# EAGLE schematic SMIW Project schematic (EAGLE 8.2.1)
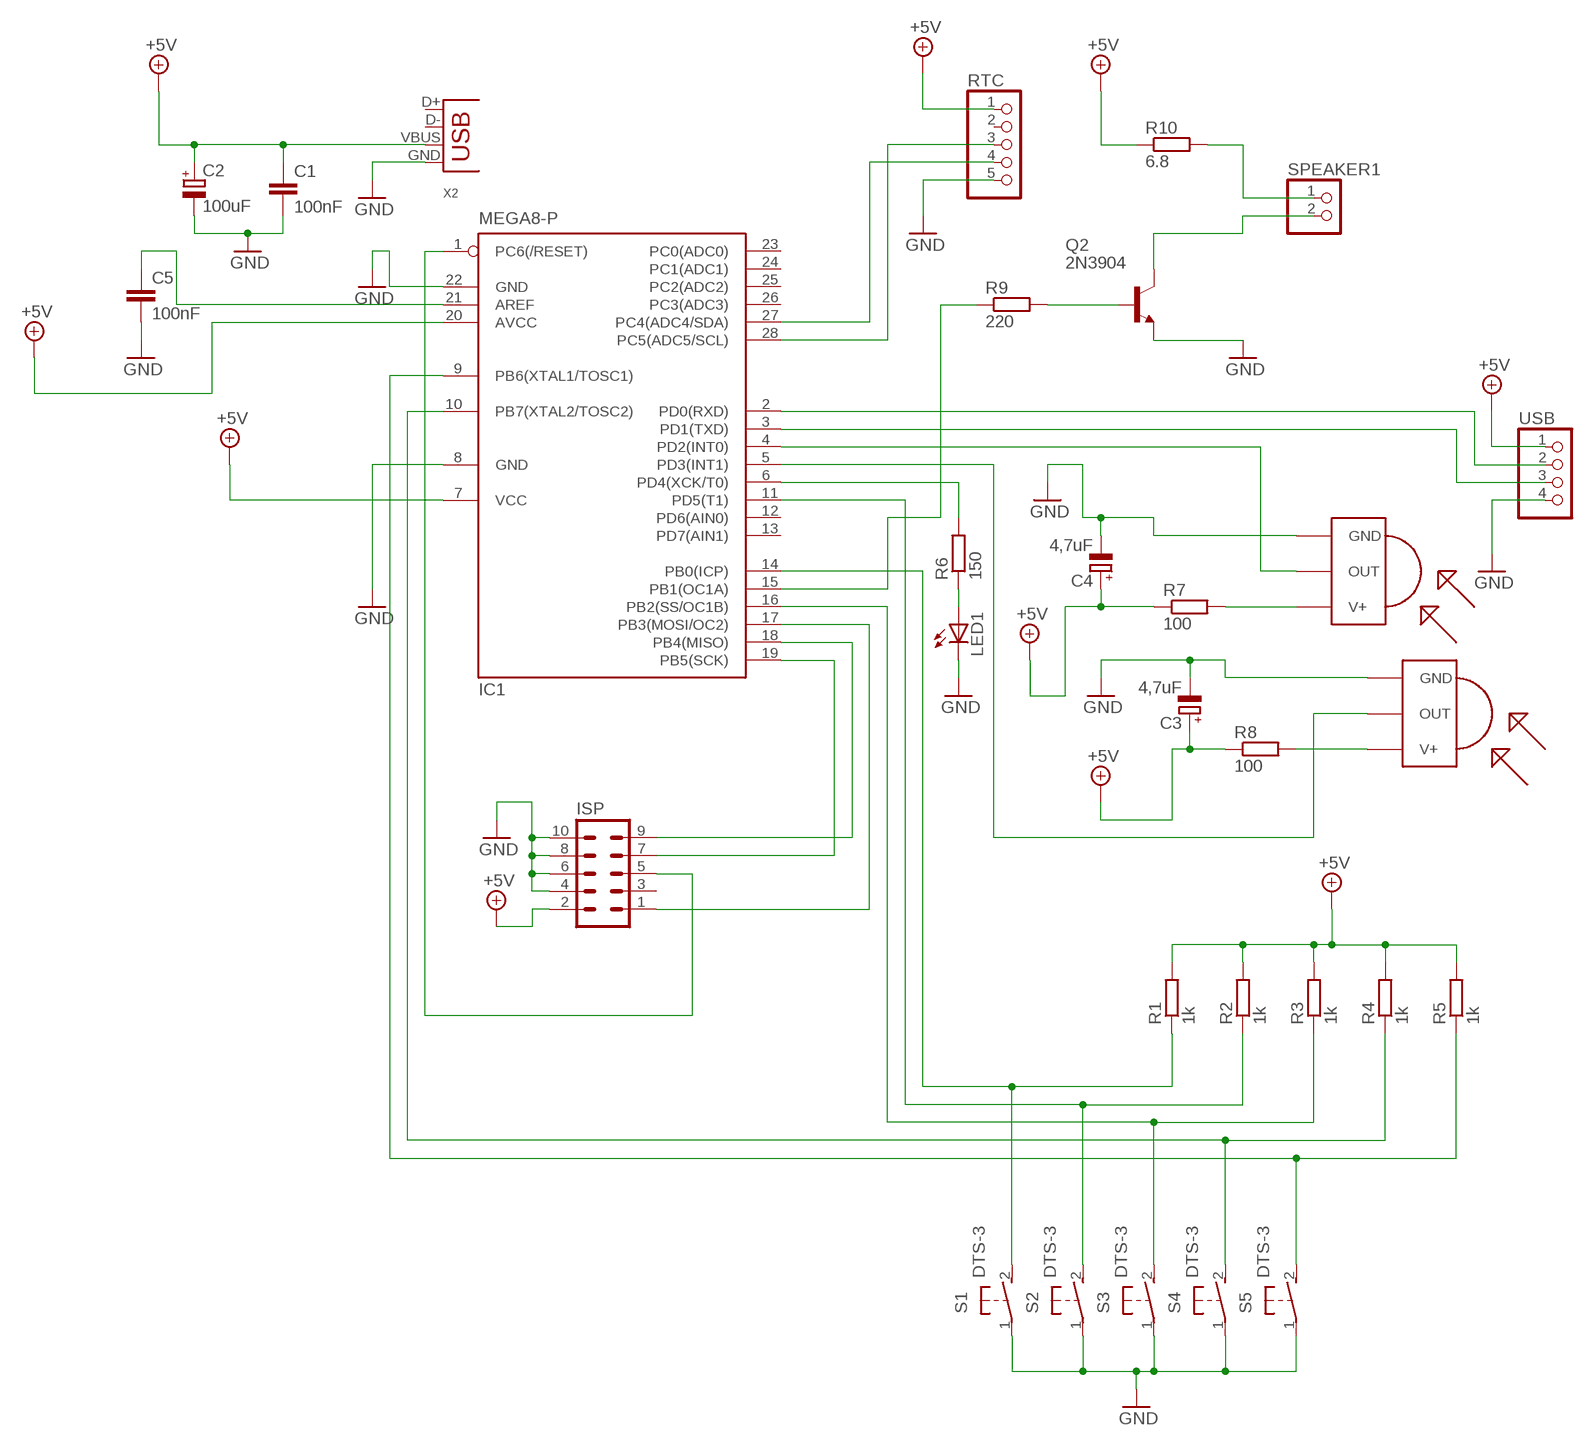
[diagram p0: schematic, sheet 1]

## Parts
C1  100nF  C2,5-3  [C2.5-3]
C2  100uF  CPOL-EUTT2D6  [TT2D6]
C3  4,7uF  CPOL-EUTT2D6  [TT2D6]
C4  4,7uF  CPOL-EUTT2D6  [TT2D6]
C5  100nF  C2,5-3  [C2.5-3]
IC1  MEGA8-P  [DIL28-3]
IRR1  TSOP4836  [TSOP18XX]
IRR2  TSOP4836  [TSOP18XX]
ISP  ML10  [ML10]
LED1  LED3MM  [LED3MM]
Q2  2N3904  [TO92]
R1  1k  R-EU_0207/5V  [0207/5V]
R2  1k  R-EU_0207/5V  [0207/5V]
R3  1k  R-EU_0207/5V  [0207/5V]
R4  1k  R-EU_0207/5V  [0207/5V]
R5  1k  R-EU_0207/5V  [0207/5V]
R6  150  R-EU_0207/5V  [0207/5V]
R7  100  R-EU_0207/5V  [0207/5V]
R8  100  R-EU_0207/5V  [0207/5V]
R9  220  R-EU_0207/5V  [0207/5V]
R10  6.8  R-EU_0207/5V  [0207/5V]
RTC  PINHD-1X5  [1X05]
S1  DTS-3  [DTS-3]
S2  DTS-3  [DTS-3]
S3  DTS-3  [DTS-3]
S4  DTS-3  [DTS-3]
S5  DTS-3  [DTS-3]
SPEAKER1  PINHD-1X2  [1X02]
USB  PINHD-1X4  [1X04]
X2  USB-B-H  [USB-B-H]

## Nets
+5V: C1.1 C2.+ C3.+ C4.+ IC1.7(VCC) IC1.20(AVCC) ISP.2 R1.2 R2.2 R3.2 R4.2 R5.2 R7.1 R8.1 R10.1 RTC.1 USB.1 X2.VBUS
GND: C1.2 C2.- C3.- C4.- C5.2 IC1.8(GND) IC1.22(GND) IRR1.GND IRR2.GND ISP.4 ISP.6 ISP.8 ISP.10 LED1.K(C) Q2.3(E) RTC.5 S1.1 S2.1 S3.1 S4.1 S5.1 USB.4 X2.GND
N$1: IC1.14(PB0(ICP)) R1.1 S1.2
N$2: IC1.11(PD5(T1)) R2.1 S2.2
N$3: IC1.16(PB2(SS/OC1B)) R3.1 S3.2
N$4: IC1.10(PB7(XTAL2/TOSC2)) R4.1 S4.2
N$5: IC1.9(PB6(XTAL1/TOSC1)) R5.1 S5.2
N$6: IC1.6(PD4(XCK/T0)) R6.2
N$7: LED1.A R6.1
N$8: IRR1.VCC(V+) R7.2
N$9: IC1.3(PD1(TXD)) USB.3
N$10: IC1.5(PD3(INT1)) IRR2.OUT
N$11: IC1.4(PD2(INT0)) IRR1.OUT
N$12: IRR2.VCC(V+) R8.2
N$13: IC1.28(PC5(ADC5/SCL)) RTC.3
N$14: IC1.2(PD0(RXD)) USB.2
N$15: IC1.27(PC4(ADC4/SDA)) RTC.4
N$16: Q2.1(C) SPEAKER1.2
N$17: IC1.15(PB1(OC1A)) R9.1
N$18: Q2.2(B) R9.2
N$19: IC1.17(PB3(MOSI/OC2)) ISP.1
N$20: IC1.19(PB5(SCK)) ISP.7
N$21: IC1.18(PB4(MISO)) ISP.9
N$22: IC1.1(PC6(/RESET)) ISP.5
N$23: R10.2 SPEAKER1.1
N$25: C5.1 IC1.21(AREF)
Unconnected: IC1.12(PD6(AIN0)) IC1.13(PD7(AIN1)) IC1.23(PC0(ADC0)) IC1.24(PC1(ADC1)) IC1.25(PC2(ADC2)) IC1.26(PC3(ADC3)) ISP.3 RTC.2 X2.D+ X2.D-

## Library data of the parts
C1 C5 = capacitor-wima:C: CAPACITOR naming: grid - package width
C2-C4 = rcl:CPOL-EU: POLARIZED CAPACITOR, European symbol
IC1 = atmel:MEGA8-P: MICROCONTROLLER 8 Kbytes FLASH, 1 kbytes SRAM, 512 bytes EEPROM, USART, 4-channel 10 bit ADC, 2-channel 8 bit ADC Pin compatible with Atmega48, ATMega88, ATMega168 Source: avr.lbr; OC_FARNELL: unknown; OC_NEWARK: unknown
IRR1 IRR2 = tsop:TSOP4836: IR Receiver and Demodulator
ISP = con-harting-ml:ML10: HARTING; OC_FARNELL: unknown; OC_NEWARK: unknown
LED1 = led:LED: LED OSRAM: - CHIPLED LG R971, LG N971, LY N971, LG Q971, LY Q971, LO R971, LY R971 LH N974, LH R974 LS Q976, LO Q976, LY Q976 LO Q996 - Hyper CHIPLED LW Q18S LB Q993, LB Q99A, LB R99A - SideLED LS A670, LO A670, LY A670, LG A670, LP A670 LB A673, LV A673, LT A673, LW A673 LH A674 LY A675 LS A676, LA A676, LO A676, LY A676, LW A676 LS A679, LY A679, LG A679 - Hyper Micro SIDELED® LS Y876, LA Y876, LO Y876, LY Y876 LT Y87S - SmartLED LW L88C, LW L88S LB L89C, LB L89S, LG L890 LS L89K, LO L89K, LY L89K LS L896, LA L896, LO L896, LY L896 - TOPLED LS T670, LO T670, LY T670, LG T670, LP T670 LSG T670, LSP T670, LSY T670, LOP T670, LYG T670 LG T671, LOG T671, LSG T671 LB T673, LV T673, LT T673, LW T673 LH T674 LS T676, LA T676, LO T676, LY T676, LB T676, LH T676, LSB T676, LW T676 LB T67C, LV T67C, LT T67C, LS T67K, LO T67K, LY T67K, LW E67C LS E67B, LA E67B, LO E67B, LY E67B, LB E67C, LV E67C, LT E67C LW T67C LS T679, LY T679, LG T679 LS T770, LO T770, LY T770, LG T770, LP T770 LB T773, LV T773, LT T773, LW T773 LH T774 LS E675, LA E675, LY E675, LS T675 LS T776, LA T776, LO T776, LY T776, LB T776 LHGB T686 LT T68C, LB T68C - Hyper Mini TOPLED® LB M676 - Mini TOPLED Santana® LG M470 LS M47K, LO M47K, LY M47K Source: http://www.osram.convergy.de LUXEON: - LUMILED® LXK2-PW12-R00, LXK2-PW12-S00, LXK2-PW14-U00, LXK2-PW14-V00 LXK2-PM12-R00, LXK2-PM12-S00, LXK2-PM14-U00 LXK2-PE12-Q00, LXK2-PE12-R00, LXK2-PE12-S00, LXK2-PE14-T00, LXK2-PE14-U00 LXK2-PB12-K00, LXK2-PB12-L00, LXK2-PB12-M00, LXK2-PB14-N00, LXK2-PB14-P00, LXK2-PB14-Q00 LXK2-PR12-L00, LXK2-PR12-M00, LXK2-PR14-Q00, LXK2-PR14-R00 LXK2-PD12-Q00, LXK2-PD12-R00, LXK2-PD12-S00 LXK2-PH12-R00, LXK2-PH12-S00 LXK2-PL12-P00, LXK2-PL12-Q00, LXK2-PL12-R00 Source: www.luxeon.com KINGBRIGHT: KA-3528ASYC Source: www.kingbright.com
Q2 = transistor-npn:2N3904: NPN Transistor
R1-R10 = rcl:R-EU_: RESISTOR, European symbol
RTC = pinhead:PINHD-1X5: PIN HEADER
S1-S5 = switch-tact:DTS-3
SPEAKER1 = pinhead:PINHD-1X2: PIN HEADER
USB = pinhead:PINHD-1X4: PIN HEADER
X2 = con-usb-3:USB: USB Connectors